# Altium schematic sheet powercore.schdoc: Power Core
size 431 x 279 mm; DrawnBy: D. Bruey, M.Ciuffo; Organization: Synapse Product Development, LLC.; Address1: 1511 6th Ave., Suite 400; Address2: Seattle, Washington 98101; Address3: 206.381.0898; Address4: www.synapse.com; DocumentNumber: 6; SheetNumber: 6; SheetTotal: 10; PageSetup: Record=PageOptions|CenterHorizontal=True|CenterVertical=True|PrintScale=1.06|XCorrection=1.00|YCorrection=1.00|PrintKind=1|BorderSize=5000000|LeftOffset=0|BottomOffset=0|Orientation=2|PaperLength=4318|PaperWidth=2794|Scale=100|PaperSource=7|PrintQuality=200|MediaType=1|DitherType=10|PrintScaleMode=1|PaperKind=11x17|PaperIndex=3
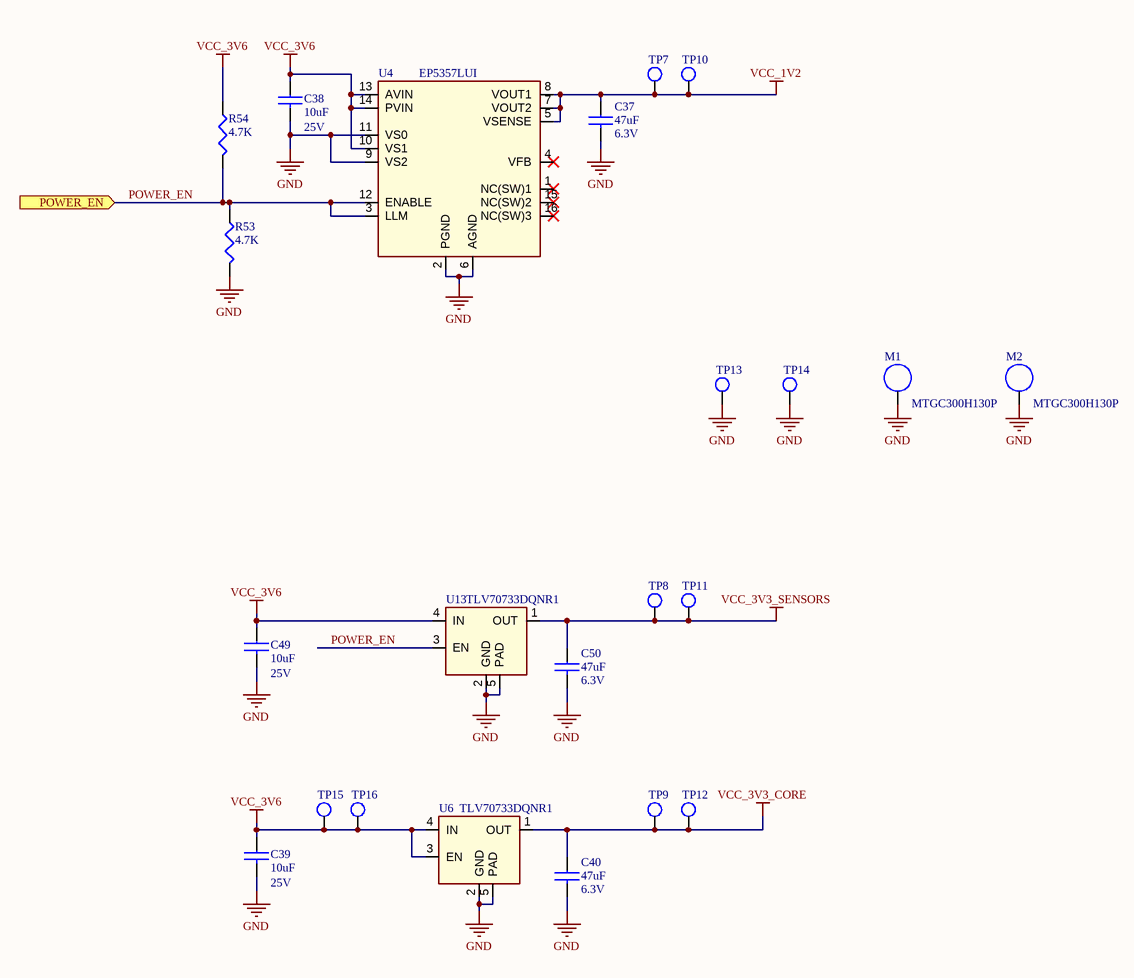
[diagram p0: powercore.schdoc]

## Parts
C37  47uF  Voltage: 6.3V  [0805-ipcsm_145]
C38  10uF  Voltage: 25V  [0603-ipcsm_90]
C39  10uF  Voltage: 25V  [0603-ipcsm_90]
C40  47uF  Voltage: 6.3V  [0805-ipcsm_145]
C49  10uF  Voltage: 25V  [0603-ipcsm_90]
C50  47uF  Voltage: 6.3V  [0805-ipcsm_145]
M1  MTGC300H130P  [MTGC300H130P]  (no BOM)
M2  MTGC300H130P  [MTGC300H130P]  (no BOM)
R53  4.7K  [0201-IPCsm_26]
R54  4.7K  [0201-IPCsm_26]
TP7  tp-1mm  [TP-S100_SMT]  (value not drawn)  (no BOM)
TP8  tp-1mm  [TP-S100_SMT]  (value not drawn)  (no BOM)
TP9  tp-1mm  [TP-S100_SMT]  (value not drawn)  (no BOM)
TP10  tp-1mm  [TP-S100_SMT]  (value not drawn)  (no BOM)
TP11  tp-1mm  [TP-S100_SMT]  (value not drawn)  (no BOM)
TP12  tp-1mm  [TP-S100_SMT]  (value not drawn)  (no BOM)
TP13  tp-1mm  [TP-S100_SMT]  (value not drawn)  (no BOM)
TP14  tp-1mm  [TP-S100_SMT]  (value not drawn)  (no BOM)
TP15  tp-1mm  [TP-S100_SMT]  (value not drawn)  (no BOM)
TP16  tp-1mm  [TP-S100_SMT]  (value not drawn)  (no BOM)
U4  EP5357LUI  [qfn16_ep5357lui]
U6  TLV70733DQNR1  [son4_tlv707dqn]
U13  TLV70733DQNR1  [son4_tlv707dqn]

## Ports
POWER_EN (in)

## Nets
GND: C37.2 C38.2 C39.2 C40.2 C49.2 C50.2 M1.1 M2.1 R53.2 TP13.1(TP) TP14.1(TP) U4.2(PGND) U4.6(AGND) U4.9(VS2) U4.11(VS0) U6.2(GND) U6.5(PAD) U13.2(GND) U13.5(PAD)
VCC_1V2: C37.1 TP7.1(TP) TP10.1(TP) U4.5(VSENSE) U4.7(VOUT2) U4.8(VOUT1)
VCC_3V3_CORE: C40.1 TP9.1(TP) TP12.1(TP) U6.1(OUT)
VCC_3V3_SENSORS: C50.1 TP8.1(TP) TP11.1(TP) U13.1(OUT)
VCC_3V6: C38.1 C39.1 C49.1 R54.1 TP15.1(TP) TP16.1(TP) U4.10(VS1) U4.13(AVIN) U4.14(PVIN) U6.3(EN) U6.4(IN) U13.4(IN)
POWER_EN: R53.1 R54.2 U4.3(LLM) U4.12(ENABLE) U13.3(EN) ; port POWER_EN

Not connected (* = marked no-connect by the designer): U4 1(NC(SW)1)* 4(VFB)* 15(NC(SW)2)* 16(NC(SW)3)*

## Notes on the sheet
- Design Notes:
- Layout Notes:
- Project:
- Sheet Title:
- PCBA:
- PROPRIETARY AND CONFIDENTIAL
- Drawn by:
- Schematic Part Number:
- Schematic Revision:
- Date:
- Sheet:
- /

## Library data of the parts
C37 C40 C50 = GRM21BR60J476ME15L: CAP CER 47UF 6.3V X5R 0805; part_type: capacitor; id: 1283; mfg: Murata; dist: DIGIKEY; dist_pn: 490-9960-1-ND; TableName: viewAltiumCapacitors; mfg_pn: GRM21BR60J476ME15L; type: X5R; height: 1.45MM; status: Unknown
C38 C39 C49 = CL10A106MA8NRNC: CAP CER 10UF 25V 20% X5R 0603; part_type: capacitor; id: 1157; mfg: Samsung Electro-Mechanics America, Inc; dist: Digikey; dist_pn: 1276-1869-1-ND; TableName: viewAltiumCapacitors; mfg_pn: CL10A106MA8NRNC; type: X5R; tolerance: 20%; height: 0.9MM; status: Unknown
M1 M2 = MTGC300H130P: MTG, 3.00 mm Pad, 1.30 mm throughhole, PLATED; part_type: mounting; id: 1180; TableName: viewAltiumMisc; mfg_pn: MTGC300H130P; dist_pn: N/A; source_package: MTGC300H130P; height: 0.05MM; status: Unknown
R53 R54 = ERJ-1GEF4701C: RES 4.70K OHM 1/20W 1% 0201 SMD; part_type: resistor; Tolerance: 1.00%; DIST: DIGIKEY; MFG: PANASONIC; DIST_PN: P4.7KABCT-ND; id: 1110; source_package: R_ 4.7K_1P_0201; TableName: viewAltiumResistors; Height: 0.26MM; MFG_PN: ERJ-1GEF4701C; status: Unknown
TP7-TP16 = TP0042: TESTPOINT, 1MM SMD, Square pad, Round SM opening; part_type: test_point; mfg_pn: TP0042; mfg: NA; id: 888; TableName: viewAltiumMisc; dist: NA; dist_pn: NA; source_package: tp_smt; status: Unknown
U4 = EP5357LUI: DC/DC CONVERTER 0.6-5.2V 3W; part_type: IC; id: 2396; mfg: Altera; dist: Digikey; dist_pn: 544-2869-1-ND; symbol: \\SYNAPSEDEV.COM\DFS\FS\EE_STUFF\CAD_LIB\MASTER\MASTER_IC\EP5357LUI; voltage: 2.4V~5.5V; OrCADSymbol: MASTER_IC\EP5357LUI; TableName: viewAltiumIcs; mfg_pn: EP5357LUI; allegro_footprint: qfn16_ep5357lui; height: 1.1mm; power: 3W; status: Unknown; datasheet: https://www.altera.com/content/dam/altera-www/global/en_US/pdfs/literature/ds/ep5357_03409.pdf; SymbolPath: C:\EE-Vault\Libraries\Schematic\MASTER_IC\EP5357LUI
U6 U13 = TLV70733DQNR1: IC REG LDO 3.3V 0.2A 4X2SON; id: 2394; mfg: TI; dist: DIGIKEY; dist_pn: 296-40637-1-ND; symbol: \\SYNAPSEDEV.COM\DFS\FS\EE_STUFF\CAD_LIB\MASTER\MASTER_IC\TLV707XX; voltage: 2V~5.5V; OrCADSymbol: MASTER_IC\TLV707XX; TableName: viewAltiumIcs; mfg_pn: TLV70733DQNR1; part_type: ic; allegro_footprint: son4_tlv707dqn; source_package: TLV70733DQNR1; height: 0.4mm; power: 0.2A; status: Unknown; datasheet: http://www.ti.com/lit/ds/symlink/tlv707.pdf; SymbolPath: C:\EE-Vault\Libraries\Schematic\MASTER_IC\TLV707XX